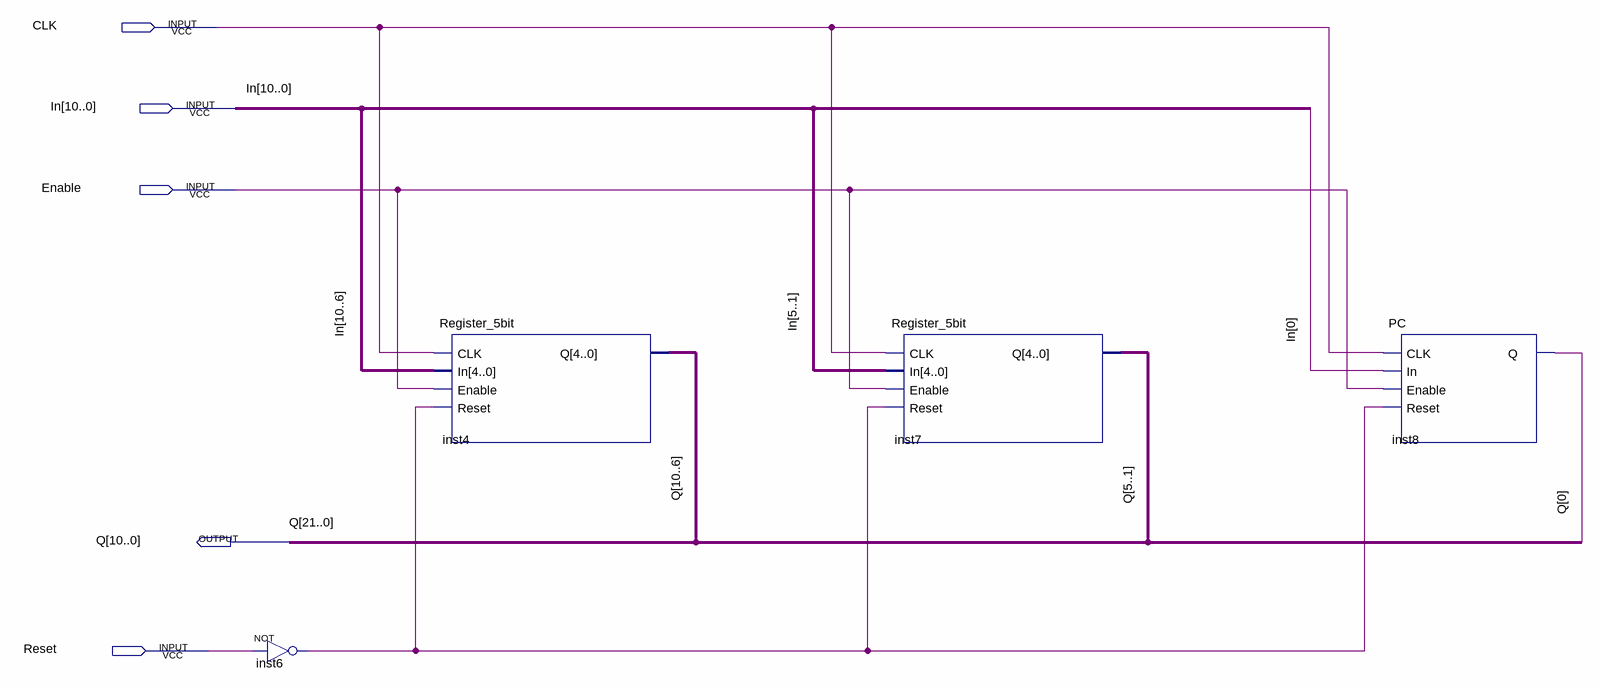
[diagram p0: schematic sheet]
// Quartus schematic Register_11bit.bdf as structural Verilog: 4 symbols, 5 pins
module Register_11bit (
  input  CLK,
  input  [10:0] In,
  input  Enable,
  input  Reset,
  output [10:0] Q
);

  wire inst6_out;

  not inst6 (inst6_out, Reset);
  Register_5bit inst4 (.CLK(CLK), .In(In[10:6]), .Enable(Enable), .Reset(inst6_out), .Q(Q[10:6]));
  Register_5bit inst7 (.CLK(CLK), .In(In[5:1]), .Enable(Enable), .Reset(inst6_out), .Q(Q[5:1]));
  PC inst8 (.CLK(CLK), .In(In[0]), .Enable(Enable), .Reset(inst6_out), .Q(Q[0]));
endmodule
